# EAGLE design slider (EAGLE 6.5.0)
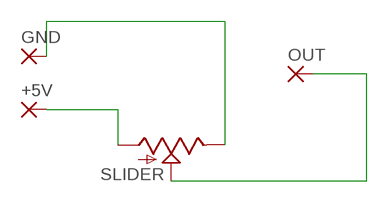
[diagram p0: schematic, sheet 1]

## Parts
+5V  2,54/1,1  [2,54/1,1]
GND  2,54/1,1  [2,54/1,1]
OUT  2,54/1,1  [2,54/1,1]
SLIDER  SLIDER20MM  [SLIDER-SMALL]

## Nets
N$1: +5V.1(P) SLIDER.BOTTOM(A)
N$2: GND.1(P) SLIDER.TOP(E)
N$3: OUT.1(P) SLIDER.WIPER(S)

## Library data of the parts
+5V GND OUT = wirepad:2,54/1,1: THROUGH-HOLE PAD
SLIDER = SparkFun-Electromechanical:SLIDER: Slide-type potentiometers. Small and meduim footprints untested.; PROD_ID: COM-11620

## Board
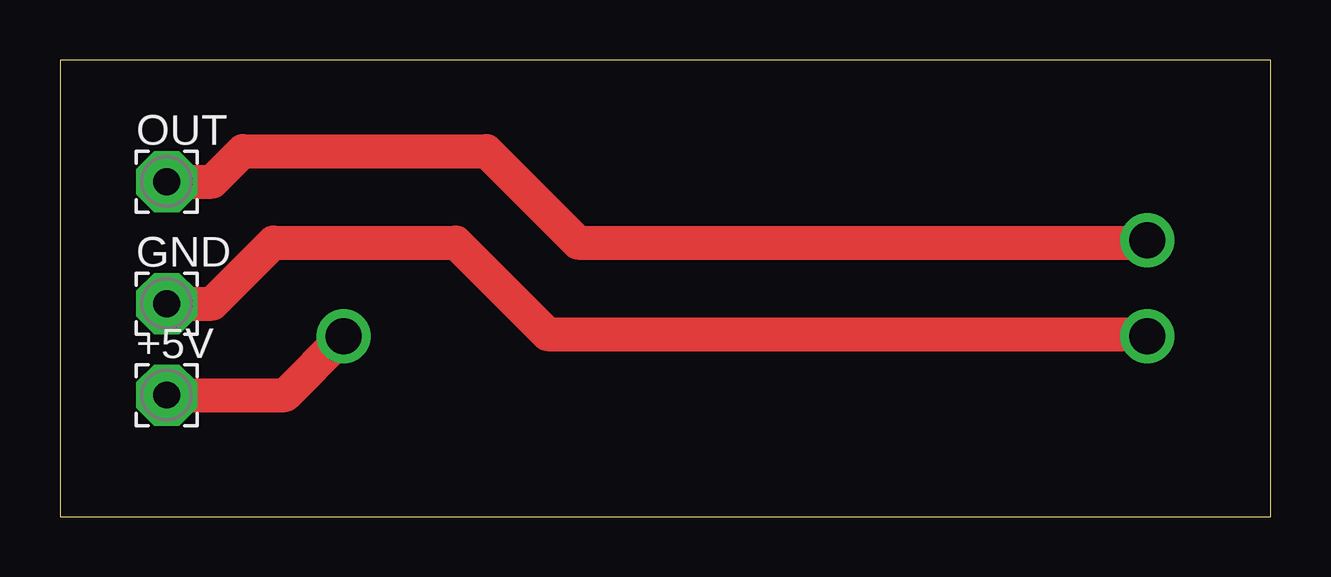
[diagram p1: board, top side]
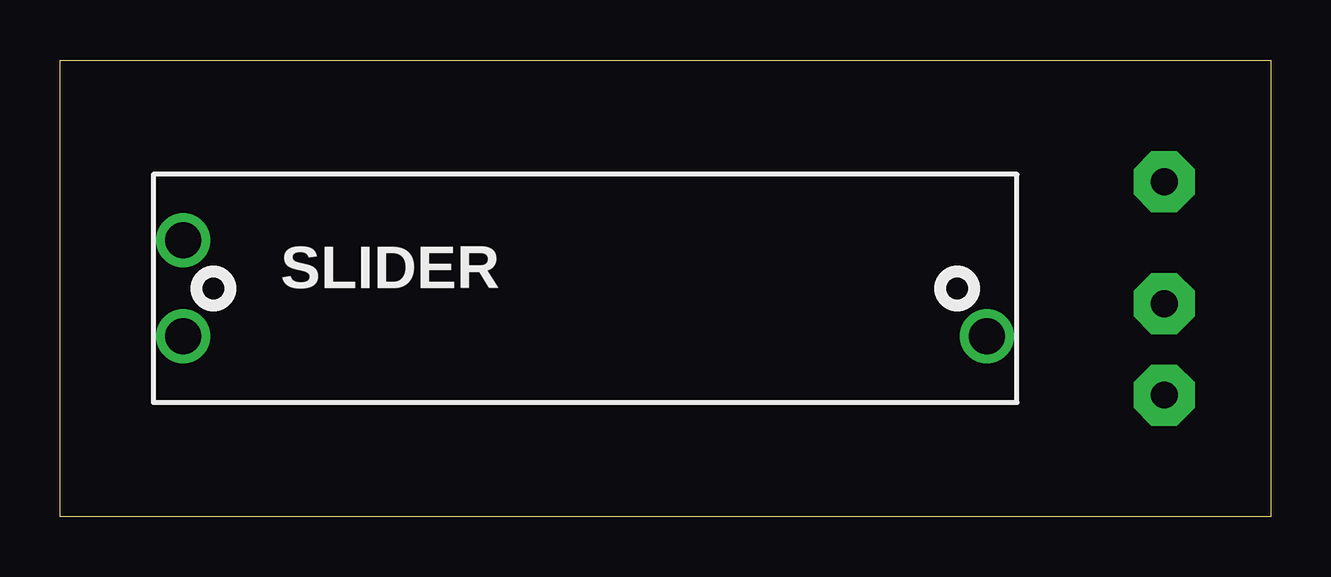
[diagram p2: board, bottom side, seen from below]

Size 50.47 x 19.04 mm. Coordinates in mm from the lower left corner, seen from the top.
Outline: 0,0 50.47,0 50.47,19.04 0,19.04 0,0
Copper layers (1*16): Top 0.035mm / dielectric 1.5mm / Bottom 0.035mm
Design rules "default *": minimum track width 36mil, minimum drill 36mil, track to track 12mil, track to pad 12mil, pad to pad 12mil, via to via 12mil, smd to smd 12mil, copper to edge 40mil, drill to drill 8mil, minimum pad ring 10mil, minimum via ring 8mil, stop-mask expansion 4mil, vias tented up to drill 0mil, thermal gap 10mil

### Footprints (pad centres in the part's own frame; a part is rotated, then mirrored left to right if it is on the bottom)
2,54/1,1 = drill 1.118 pad 2.54 octagon: 1 0,0
SLIDER-SMALL = drill 1.5: BOTTOM 16.75,-2; TOP -16.75,-2; WIPER -16.75,2

### Placement (x,y rotation side)
+5V  4.45,5.08 0 top
GND  4.45,8.89 0 top
OUT  4.45,13.97 0 top
SLIDER  28.57,9.53 0 bottom

### Tracks (layer width: path | path; a pad name or v marks a point on that pad's centre or on a via)
N$1
  Top 1.422: +5V.1 9.38,5.08 SLIDER.BOTTOM
N$2
  Top 1.422: GND.1 6.35,8.89 8.89,11.43 16.51,11.43 20.32,7.62 45.23,7.62 SLIDER.TOP
N$3
  Top 1.422: OUT.1 6.35,13.97 7.62,15.24 17.78,15.24 21.59,11.43 45.23,11.43 SLIDER.WIPER